# Altium schematic sheet RS-485_422.SchDoc
size A4
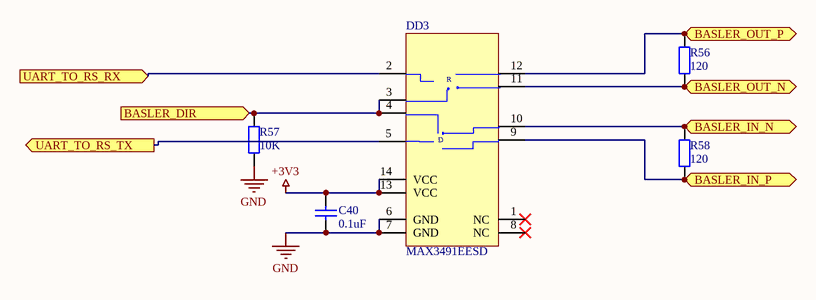
[diagram p0: RS-485_422.SchDoc]

## Parts
C40  value 0.1uF  [C0603]  (hidden comment: C0603-0.1uF-50V-10%)
DD3  MAX3491EESD  [SO14]
R56  value 120  [R0603]  (hidden comment: R0603-120-1%)
R57  value 10K  [R0603]  (hidden comment: R0603-10K-1%)
R58  value 120  [R0603]  (hidden comment: R0603-120-1%)

## Ports
BASLER_DIR (in), BASLER_IN_N (bidir), BASLER_IN_P (bidir), BASLER_OUT_N (bidir), BASLER_OUT_P (bidir), UART_TO_RS_RX (in), UART_TO_RS_TX (out)

## Nets
+3V3: C40.2 DD3.13(VCC) DD3.14(VCC)
GND: C40.1 DD3.6(GND) DD3.7(GND) R57.1
BASLER_DIR: DD3.3(~{RE}) DD3.4(DE) R57.2 ; port BASLER_DIR
BASLER_IN_N: DD3.10(Z) R58.2 ; port BASLER_IN_N
BASLER_IN_P: DD3.9(Y) R58.1 ; port BASLER_IN_P
BASLER_OUT_N: DD3.11(B) R56.1 ; port BASLER_OUT_N
BASLER_OUT_P: DD3.12(A) R56.2 ; port BASLER_OUT_P
UART_TO_RS_RX: DD3.2(RO) ; port UART_TO_RS_RX
UART_TO_RS_TX: DD3.5(DI) ; port UART_TO_RS_TX

Not connected (* = marked no-connect by the designer): DD3 1(NC)* 8(NC)*

## Notes on the sheet
- (in symbol MAX3491EESD) R; D

## Library data of the parts
C40 = C0603-0.1uF-50V-10%: Ceramic Capacitor; InternalName: Конд 0603 X7R 10% 50 В 0,1 мкФ; Voltage: 50V
DD3 = MAX3491EESD: Low-Power, Slew-Rate-Limited RS-485/RS-422 Transceiver
R56 R58 = R0603-120-1%: Chip Resistor; Supplier 1: Digi-Key; Supplier Part Number 1: P120HCT-ND
R57 = R0603-10K-1%: Chip Resistor; Supplier 1: Digi-Key; Supplier Part Number 1: P10.0KHCT-ND